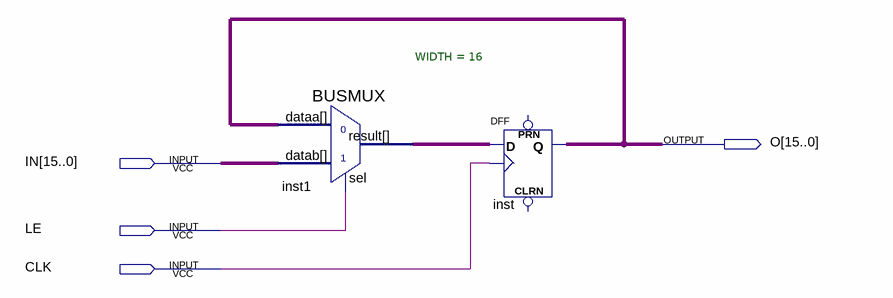
[diagram p0: schematic sheet]
// Quartus schematic REGISTER16BIT.bdf as structural Verilog: 2 symbols, 4 pins
module REGISTER16BIT (
  input  [15:0] IN,
  input  LE,
  input  CLK,
  output [15:0] O
);

  wire [15:0] inst1_result;

  BUSMUX #(.WIDTH(16)) inst1 (.datab(IN), .sel(LE), .dataa(O), .result(inst1_result));
  DFF inst[15:0] (.CLK(CLK), .D(inst1_result), .Q(O));  // open: CLRN, PRN
endmodule
